# EAGLE schematic QuadHybridV1 (EAGLE 6.1)
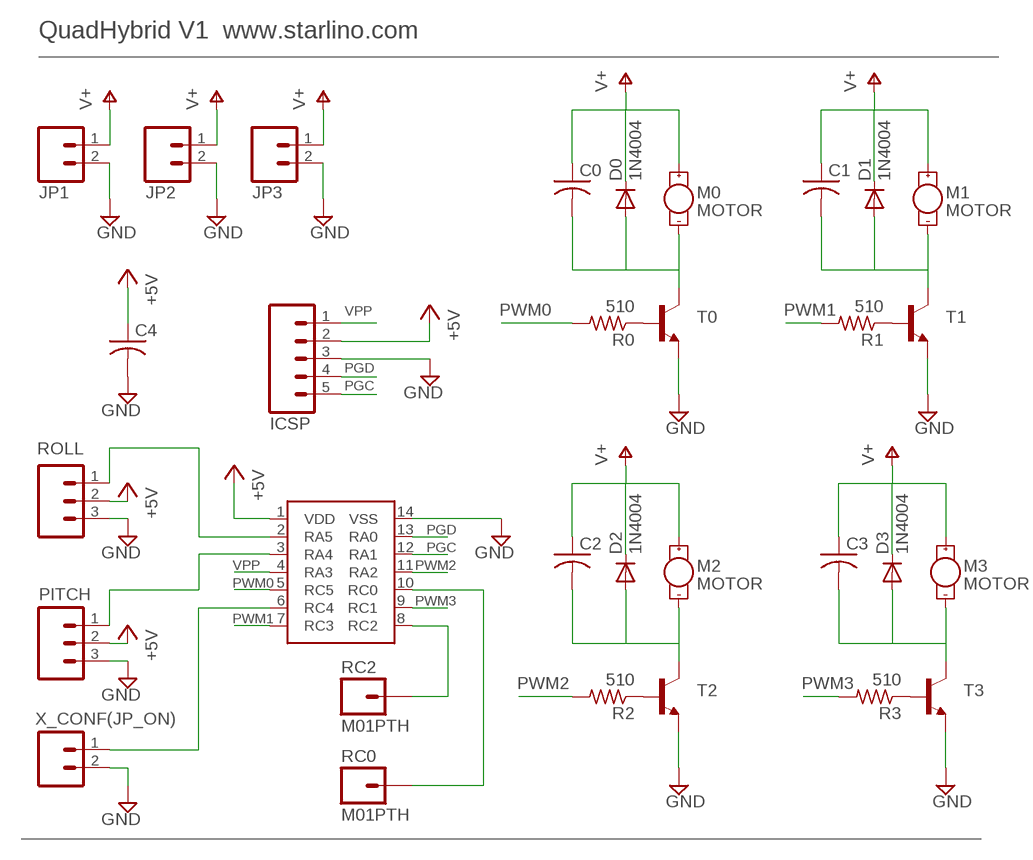
[diagram p0: schematic, sheet 1]

## Parts
C0  C-US025-024X044  [C025-024X044]
C1  C-US025-024X044  [C025-024X044]
C2  C-US025-024X044  [C025-024X044]
C3  C-US025-024X044  [C025-024X044]
C4  C-US025-024X044  [C025-024X044]
D0  1N4004  [DO41-10]
D1  1N4004  [DO41-10]
D2  1N4004  [DO41-10]
D3  1N4004  [DO41-10]
ICSP  M05PTH  [1X05]
JP1  M02PTH  [1X02]
JP2  M02PTH  [1X02]
JP3  M02PTH  [1X02]
M0  MOTOR  [1X02]
M1  MOTOR  [1X02]
M2  MOTOR  [1X02]
M3  MOTOR  [1X02]
PIC16F1825  PIC16F1825PDIP  [DIL14]
PITCH  M03PTH  [1X03]
R0  510  R-US_0207/10  [0207/10]
R1  510  R-US_0207/10  [0207/10]
R2  510  R-US_0207/10  [0207/10]
R3  510  R-US_0207/10  [0207/10]
RC0  M01PTH  [1X01]
RC2  M01PTH  [1X01]
ROLL  M03PTH  [1X03]
T0  -NPN-TO92-ECB  [TO92-ECB]
T1  -NPN-TO92-ECB  [TO92-ECB]
T2  -NPN-TO92-ECB  [TO92-ECB]
T3  -NPN-TO92-ECB  [TO92-ECB]
X_CONF(JP_ON)  M02PTH  [1X02]

## Nets
+5V: C4.1 ICSP.2 PIC16F1825.1(VDD) PITCH.2 ROLL.2
GND: C4.2 ICSP.3 JP1.2 JP2.2 JP3.2 PIC16F1825.14(VSS) PITCH.3 ROLL.3 T0.E T1.E T2.E T3.E X_CONF(JP_ON).2
N$1: C0.2 D0.A M0.2(-) T0.C
N$2: C1.2 D1.A M1.2(-) T1.C
N$3: PIC16F1825.8(RC2) RC2.1
N$4: PIC16F1825.6(RC4) X_CONF(JP_ON).1
N$5: C2.2 D2.A M2.2(-) T2.C
N$6: PIC16F1825.10(RC0) RC0.1
N$7: C3.2 D3.A M3.2(-) T3.C
N$8: R0.1 T0.B
N$9: PIC16F1825.2(RA5) ROLL.1
N$10: PIC16F1825.3(RA4) PITCH.1
N$11: R1.1 T1.B
N$12: R2.1 T2.B
N$13: R3.1 T3.B
PGC: ICSP.5 PIC16F1825.12(RA1)
PGD: ICSP.4 PIC16F1825.13(RA0)
PWM0: PIC16F1825.5(RC5) R0.2
PWM1: PIC16F1825.7(RC3) R1.2
PWM2: PIC16F1825.11(RA2) R2.2
PWM3: PIC16F1825.9(RC1) R3.2
V+: C0.1 C1.1 C2.1 C3.1 D0.C D1.C D2.C D3.C JP1.1 JP2.1 JP3.1 M0.1(+) M1.1(+) M2.1(+) M3.1(+)
VPP: ICSP.1 PIC16F1825.4(RA3)

## Notes on the sheet
- QuadHybrid V1  www.starlino.com
- VPP | PWM0 | PWM1
- PGD
- PGC
- PGD
- PGC
- VPP | PWM2
- PWM0
- PWM3
- PWM1
- PWM2 | PWM3

## Library data of the parts
C0 C1-C4 = rcl:C-US: CAPACITOR, American symbol
D0 D1-D3 = diode:1N4004: DIODE general purpose rectifier, 1 A
ICSP = SparkFun:M05: Header 5 Standard 5-pin 0.1" header. Use with straight break away headers (SKU : PRT-00116), right angle break away headers (PRT-00553), swiss pins (PRT-00743), machine pins (PRT-00117), and female headers (PRT-00115). Molex polarized connector foot print use with SKU : PRT-08230 with associated crimp pins and housings.
JP1-JP3 X_CONF(JP_ON) = SparkFun:M02: Header 2 Standard 2-pin 0.1" header. Use with straight break away headers (SKU : PRT-00116), right angle break away headers (PRT-00553), swiss pins (PRT-00743), machine pins (PRT-00117), and female headers (PRT-00115). Molex polarized connector foot print use with SKU : PRT-08233 with associated crimp pins and housings.
M0 M1-M3 = SparkFun:MOTOR: Vibration Motor Physical dimension and wire connections for this powerful vibration motor. Motor has a self adhesive backing. Spark Fun Electronics SKU : ROB-08449
PIC16F1825 = PIC16F1825:PIC16F1825
PITCH ROLL = SparkFun:M03: Header 3 Standard 3-pin 0.1" header. Use with straight break away headers (SKU : PRT-00116), right angle break away headers (PRT-00553), swiss pins (PRT-00743), machine pins (PRT-00117), and female headers (PRT-00115). Molex polarized connector foot print use with SKU : PRT-08232 with associated crimp pins and housings.
R0 R1-R3 = rcl:R-US_: RESISTOR, American symbol
RC0 RC2 = SparkFun:M01: Header 1 Standard 1-pin 0.1" header. Use with straight break away headers (SKU : PRT-00116), right angle break away headers (PRT-00553), swiss pins (PRT-00743), machine pins (PRT-00117), and female headers (PRT-00115).
T0 T1-T3 = transistor:*-NPN-: NPN Transistror BF959 corrected 2008.03.06